# Altium schematic sheet wristband5.SchDoc
size A
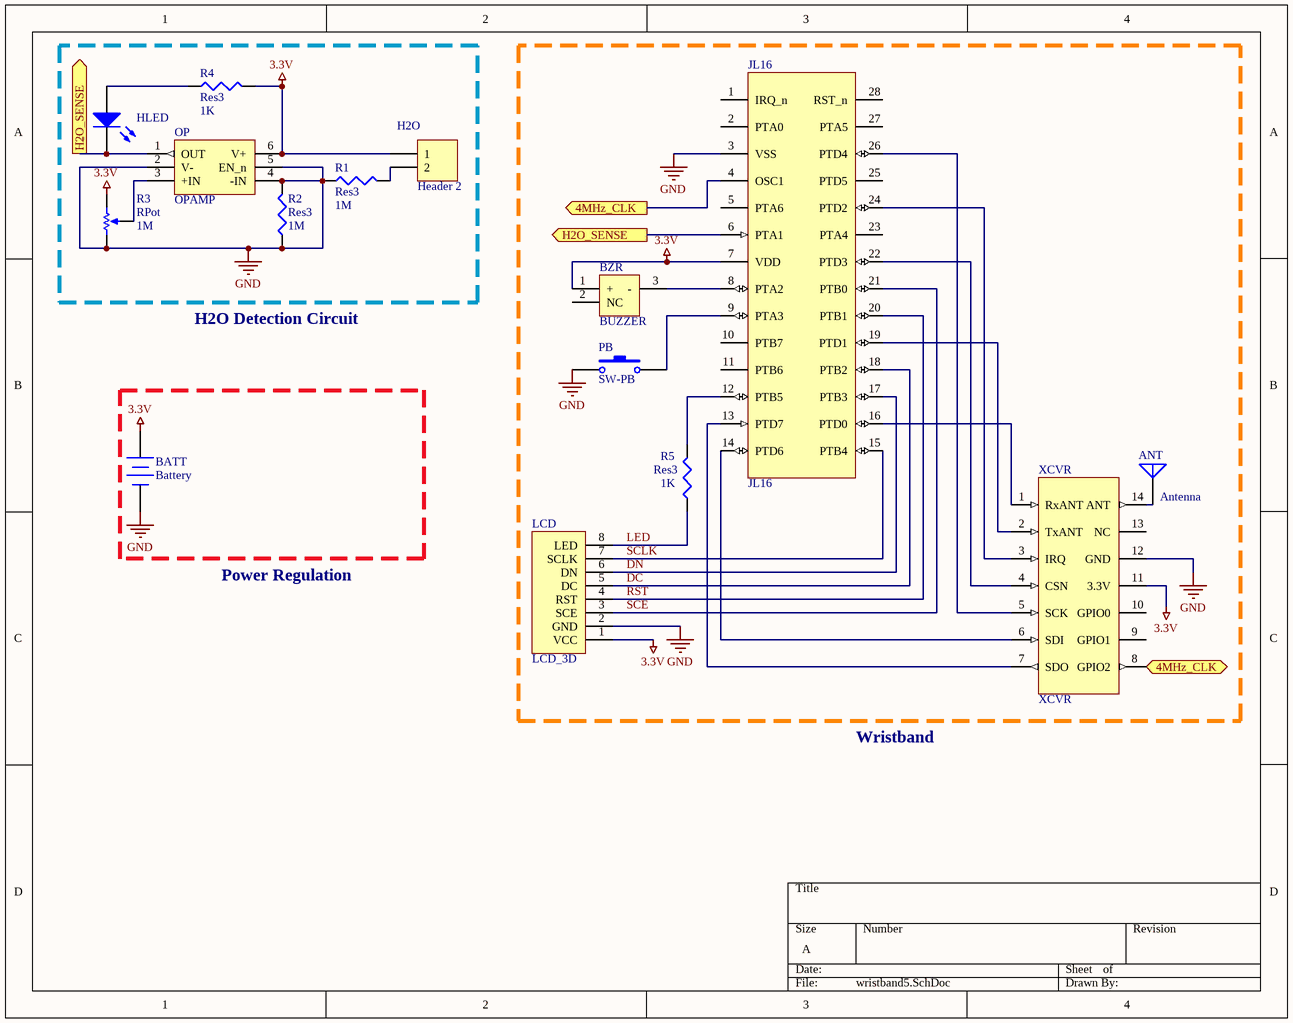
[diagram p0: wristband5.SchDoc]

## Parts
ANT  Antenna  [PIN1]
BATT  Battery  [BAT-2]
BZR  BUZZER  [BUZZER_SOJ]
H2O  Header 2  [HDR1X2]
HLED  LED2  [3.2X1.6X1.1]  (value not drawn)
JL16  JL16  [JL16_QUAD32]
LCD  LCD_3D  [LCD]
OP  OPAMP  [OPAMP_SOP6]
PB  SW-PB  [SPST-2]
R1  Res3  value 1M  [J1-0603]
R2  Res3  value 1M  [J1-0603]
R3  RPot  value 1M  [POT]
R4  Res3  value 1K  [J1-0603]
R5  Res3  value 1K  [J1-0603]
XCVR  XCVR  [XCVR_SOP16]

## Ports
4MHz_CLK (out), H2O_SENSE (out)

## Nets
3.3V: BATT.1(+) BZR.1(+) H2O.1 JL16.7(VDD) LCD.1(VCC) OP.6(V+) R3.2(BOT) R4.2 XCVR.11(3.3V)
GND: BATT.2(-) JL16.3(VSS) LCD.2(GND) OP.2(V-) OP.4(-IN) OP.5(EN_n) PB.1 R1.1 R2.1 R2.2 R3.1(TOP) XCVR.12(GND)
4MHz_CLK: JL16.4(OSC1) XCVR.8(GPIO2) ; port 4MHz_CLK
DC: JL16.18(PTB2) LCD.5(DC)
DN: JL16.17(PTB3) LCD.6(DN)
H2O_SENSE: HLED.2(K) JL16.6(PTA1) OP.1(OUT) ; port H2O_SENSE
LED: LCD.8(LED) R5.1
RST: JL16.20(PTB1) LCD.4(RST)
SCE: JL16.21(PTB0) LCD.3(SCE)
SCLK: JL16.15(PTB4) LCD.7(SCLK)
NetANT_1: ANT.1(A) XCVR.14(ANT)
NetBZR_3: BZR.3(-) JL16.8(PTA2)
NetH2O_2: H2O.2 R1.2
NetHLED_1: HLED.1(A) R4.1
NetJL16_9: JL16.9(PTA3) PB.2
NetJL16_12: JL16.12(PTB5) R5.2
NetJL16_13: JL16.13(PTD7) XCVR.7(SDO)
NetJL16_14: JL16.14(PTD6) XCVR.6(SDI)
NetJL16_16: JL16.16(PTD0) XCVR.1(RxANT)
NetJL16_19: JL16.19(PTD1) XCVR.2(TxANT)
NetJL16_22: JL16.22(PTD3) XCVR.4(CSN)
NetJL16_24: JL16.24(PTD2) XCVR.3(IRQ)
NetJL16_26: JL16.26(PTD4) XCVR.5(SCK)
NetOP_3: OP.3(+IN) R3.3(TAP)

Not connected (* = marked no-connect by the designer): BZR 2(NC); JL16 1(IRQ_n) 2(PTA0) 5(PTA6) 10(PTB7) 11(PTB6) 23(PTA4) 25(PTD5) 27(PTA5) 28(RST_n); XCVR 9(GPIO1) 10(GPIO0) 13(NC)

## Notes on the sheet
- H2O Detection Circuit
- Power Regulation
- Wristband

## Library data of the parts
ANT = Antenna: Generic Antenna; Published: 24-Mar-1999; LatestRevisionDate: 17-Jul-2002; LatestRevisionNote: Re-released for DXP Platform.; PackageReference: PIN1; Publisher: Altium Limited
BATT = Battery: Multicell Battery; Published: 24-Mar-1999; LatestRevisionDate: 17-Jul-2002; LatestRevisionNote: Re-released for DXP Platform.; PackageReference: BAT-2; Publisher: Altium Limited
H2O = Header 2: Header, 2-Pin; LatestRevisionDate: 17-Jul-2002; LatestRevisionNote: Re-released for DXP Platform.; Publisher: Altium Limited
HLED = LED2: Typical RED, GREEN, YELLOW, AMBER GaAs LED; Published: 8-Jun-2000; LatestRevisionDate: 17-Jul-2002; LatestRevisionNote: Re-released for DXP Platform.; PackageDocument: Feb-2002; PackageReference: 3.2X1.6X1.1; Publisher: Altium Limited
JL16 = JL16: Freescale MC908JL16
OP = OPAMP: LT6230CS6
PB = SW-PB: Switch; Published: 24-Mar-1999; LatestRevisionDate: 17-Jul-2002; LatestRevisionNote: Re-released for DXP Platform.; PackageReference: SPST-2; Publisher: Altium Limited
R1 R2 R4 R5 = Res3: Resistor; Published: 8-Jun-2000; LatestRevisionDate: 04-Mar-2005; LatestRevisionNote: PCB Footprint replaced.; PackageReference: J1-0603; Publisher: Altium Limited
R3 = RPot: Potentiometer; Sim Note: Enter the Resistance value and the set point into parameter fields.; Set Position: 0.5; Published: 8-Jun-2000; LatestRevisionDate: 17-Jul-2002; LatestRevisionNote: Re-released for DXP Platform.; PackageReference: VR5; Publisher: Altium Limited
XCVR = XCVR: RFM22B